# Altium project WS-LORA.PrjPcb
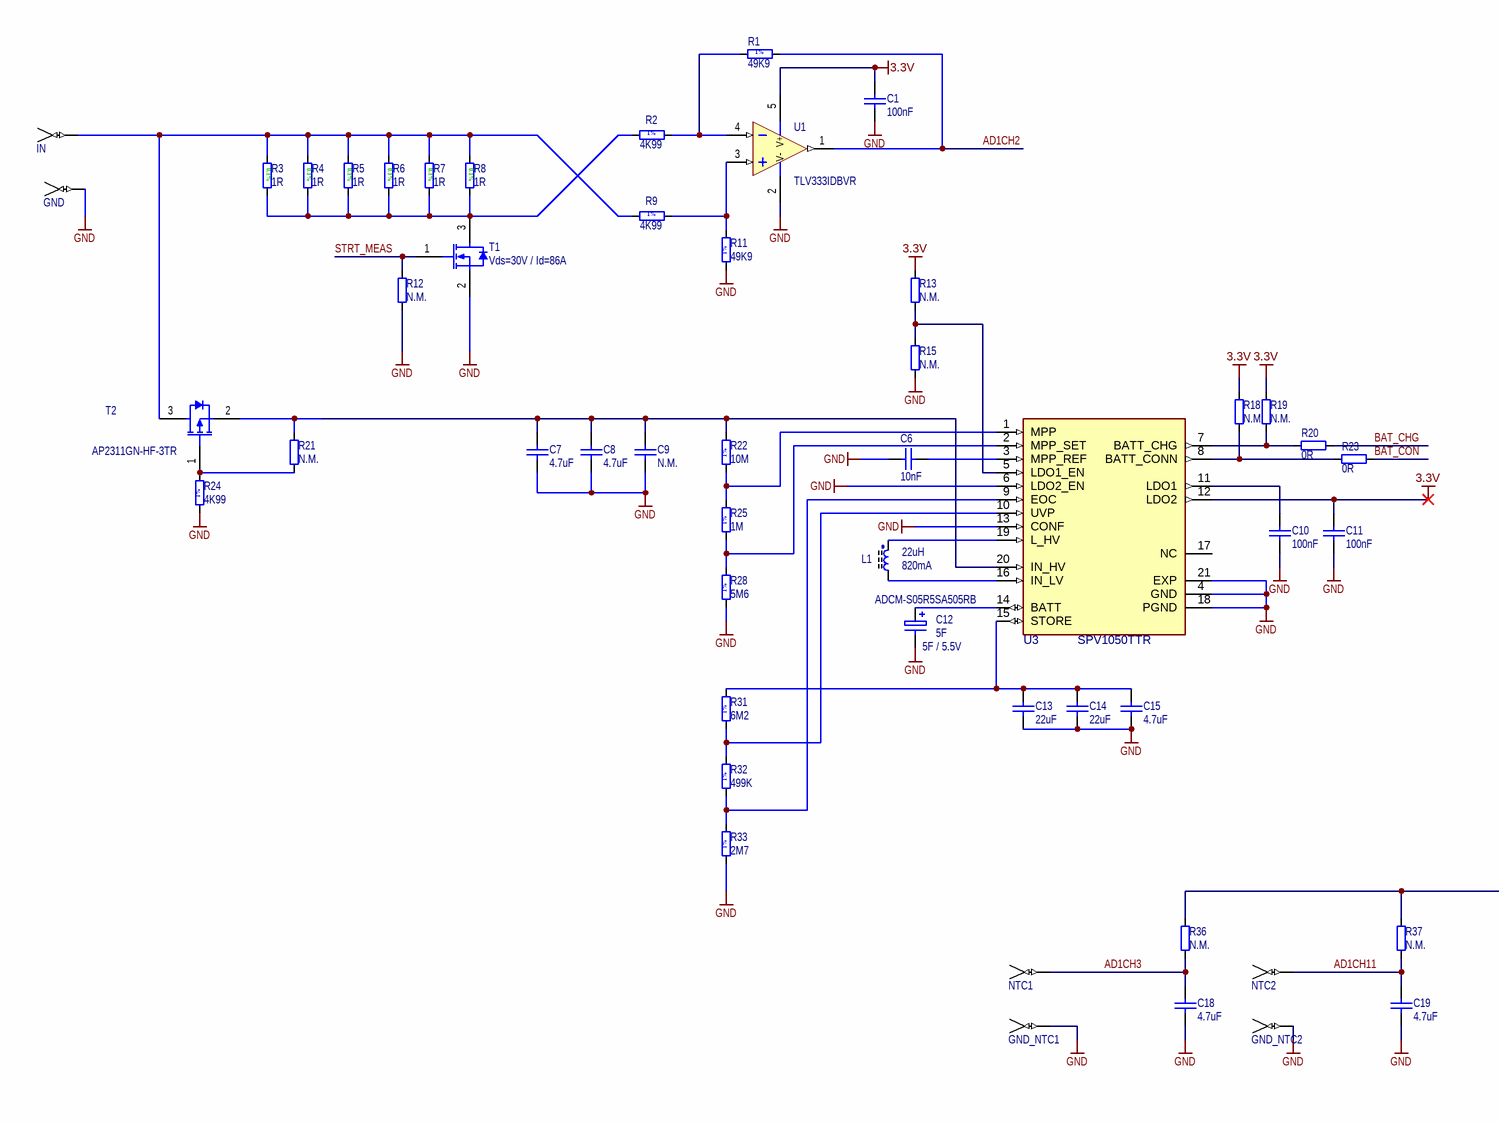
[diagram p0: LORATA.SchDoc, left]
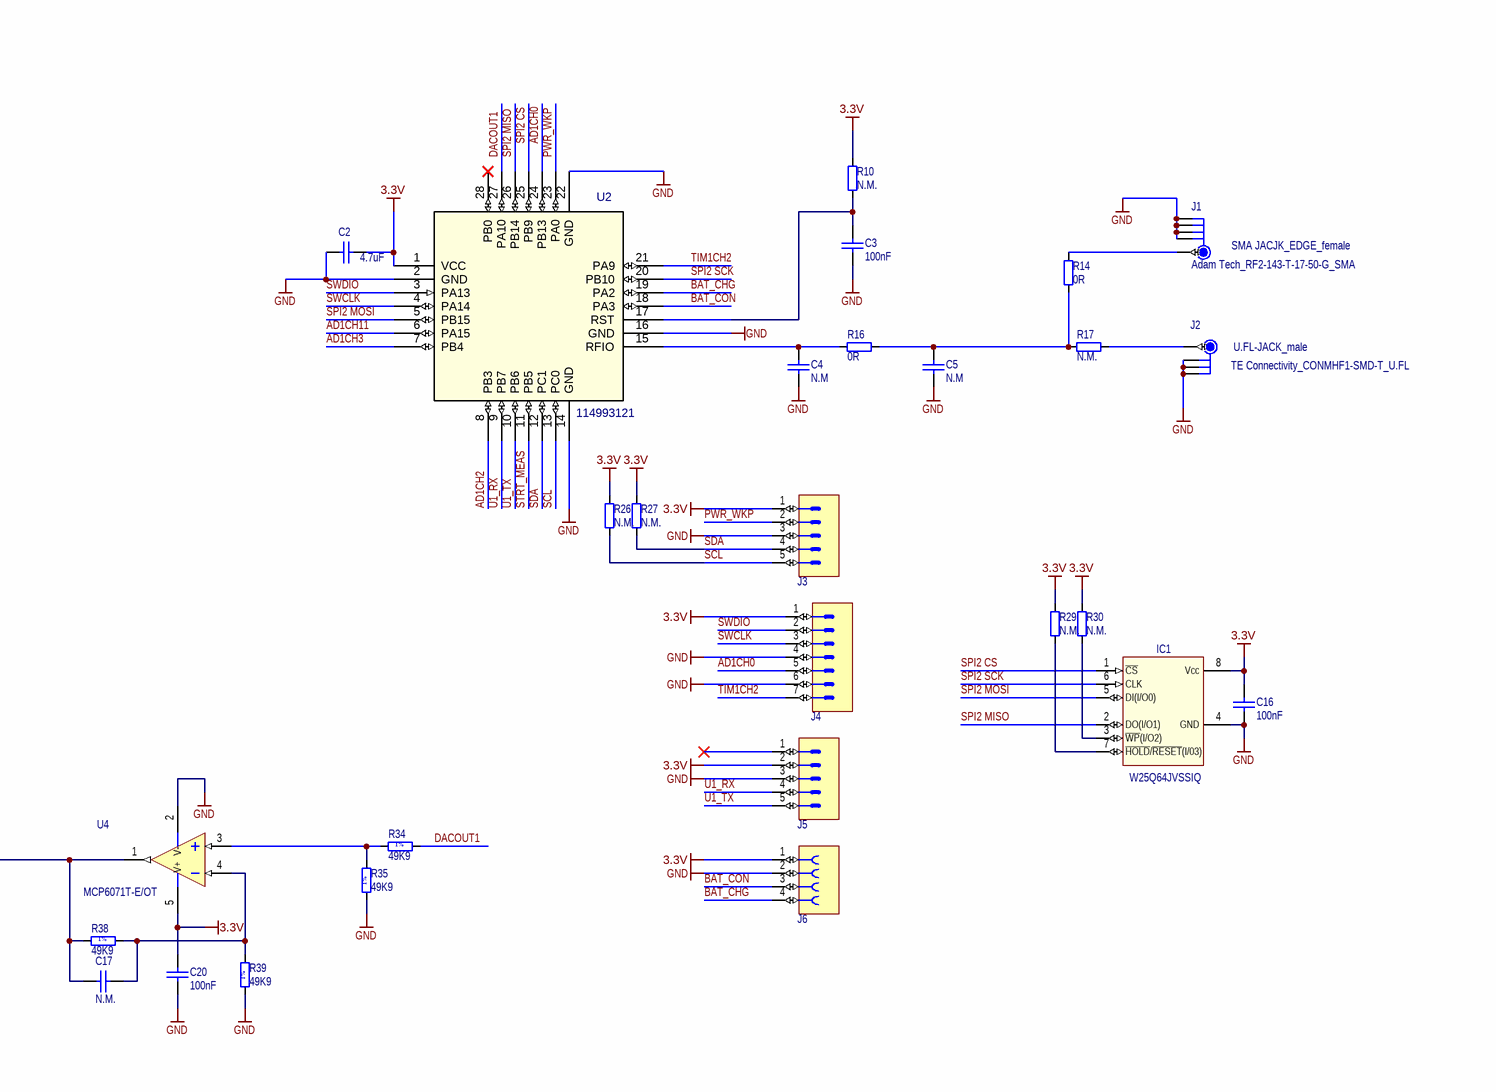
[diagram p1: LORATA.SchDoc, right]
1 sheet, 79 parts. Net scope: global (net labels, ports and power ports of the same name join across sheets).
Board file: WS_LORA.PcbDoc

## Sheet LORATA.SchDoc
size A2; DocumentNumber: 2; SheetNumber: 2; SheetTotal: 4

### Parts
C1  100nF  [CAPC1608N]
C2  4.7uF  [CAPC3216N]
C3  100nF  [CAPC1608N]
C4  N.M  [CAPC1608N]
C5  N.M  [CAPC1608N]
C6  10nF  [CAPC1608N]
C7  4.7uF  [CAPC3216N]
C8  4.7uF  [CAPC3216N]
C9  N.M.  [CAPC2012N]
C10  100nF  [CAPC1608N]
C11  100nF  [CAPC1608N]
C12  5F  Comment_Ratings: 5F / 5.5V  Manufacturer Part Number: ADCM-S05R5SA505RB  [CAPR1530x1050X2050X2800]
C13  22uF  [CAPC3225N]
C14  22uF  [CAPC3225N]
C15  4.7uF  [CAPC3216N]
C16  100nF  [CAPC1608N]
C17  N.M.  [CAPC2012N]
C18  4.7uF  [CAPC3216N]
C19  4.7uF  [CAPC3216N]
C20  100nF  [CAPC1608N]
GND  (no value)  [PIN_1.5MM_HOLE]  (no BOM)
GND_NTC1  (no value)  [PIN_1.5MM_HOLE]  (no BOM)
GND_NTC2  (no value)  [PIN_1.5MM_HOLE]  (no BOM)
IC1  W25Q64JVSSIQ  [SOIC127P600-8N]
IN  (no value)  [PIN_1.5MM_HOLE]  (no BOM)
J1  SMA JACJK_EDGE_female  Part Number: Adam Tech_RF2-143-T-17-50-G_SMA  [Adam Tech_RF2-143-T-17-50-G]
J2  U.FL-JACK_male  Part Number: TE Connectivity_CONMHF1-SMD-T_U.FL  [LINX_CONMHF1-SMD-T]
J3  HEADER 1X5  [HDR1X5]  (value not drawn)
J4  HEADER 1X7  [HDR1X7]  (value not drawn)
J5  HEADER 1X5  [HDR1X5]  (value not drawn)
J6  Header Female  [HARWIN_M20-7820442]  (value not drawn)
L1  22uH  Power: 820mA  [IND_Taiyo_NRS5024]
NTC1  (no value)  [PIN_1.5MM_HOLE]  (no BOM)
NTC2  (no value)  [PIN_1.5MM_HOLE]  (no BOM)
R1  49K9  [RESC1608N(0603)]
R2  4K99  [RESC2012N(0805)]
R3  1R  [RESC3216N(1206)]
R4  1R  [RESC3216N(1206)]
R5  1R  [RESC3216N(1206)]
R6  1R  [RESC3216N(1206)]
R7  1R  [RESC3216N(1206)]
R8  1R  [RESC3216N(1206)]
R9  4K99  [RESC2012N(0805)]
R10  N.M.  [RESC1608N(0603)]
R11  49K9  [RESC1608N(0603)]
R12  N.M.  [RESC1608N(0603)]
R13  N.M.  [RESC1608N(0603)]
R14  0R  [RESC1608N(0603)]
R15  N.M.  [RESC1608N(0603)]
R16  0R  [RESC1608N(0603)]
R17  N.M.  [RESC1608N(0603)]
R18  N.M.  [RESC1608N(0603)]
R19  N.M.  [RESC1608N(0603)]
R20  0R  [RESC1608N(0603)]
R21  N.M.  [RESC1608N(0603)]
R22  10M  [RESC2012N(0805)]
R23  0R  [RESC1608N(0603)]
R24  4K99  [RESC2012N(0805)]
R25  1M  [RESC2012N(0805)]
R26  N.M.  [RESC1608N(0603)]
R27  N.M.  [RESC1608N(0603)]
R28  5M6  [RESC2012N(0805)]
R29  N.M.  [RESC1608N(0603)]
R30  N.M.  [RESC1608N(0603)]
R31  6M2  [RESC2012N(0805)]
R32  499K  [RESC2012N(0805)]
R33  2M7  [RESC2012N(0805)]
R34  49K9  [RESC1608N(0603)]
R35  49K9  [RESC1608N(0603)]
R36  N.M.  [RESC1608N(0603)]
R37  N.M.  [RESC1608N(0603)]
R38  49K9  [RESC1608N(0603)]
R39  49K9  [RESC1608N(0603)]
T1  Comment_Ratings: Vds=30V / Id=86A  [TO228P991X239-3N-R546X521]  (hidden comment: IRLR8726PBF)
T2  AP2311GN-HF-3TR  [SOT95P240X130-3N]
U1  TLV333IDBVR  [SOT95P280X145-5N]
U2  114993121  [QFN_90687_SEE-L]
U3  SPV1050TTR  [QFN40P300X300X100-21N]
U4  MCP6071T-E/OT  [SOT95P280X145-5N]

### Nets
3.3V: C1.2 C2.2 C11.2 C16.2 C20.2 IC1.8(Vcc) J3.1 J4.1 J5.2 J6.1 R10.2 R13.2 R18.2 R19.2 R26.2 R27.2 R29.2 R30.2 U1.5(V+) U2.1(VCC) U3.12(LDO2) U4.5(V+)
GND: C1.1 C2.1 C3.1 C4.1 C5.1 C6.2 C7.1 C8.1 C9.1 C10.1 C11.1 C12.2 C13.1 C14.1 C15.1 C16.1 C18.1 C19.1 C20.1 GND.1 GND_NTC1.1 GND_NTC2.1 IC1.4(GND) J1.2 J1.3 J1.4 J1.5 J2.2 J2.3 J2.4 J3.3 J4.4 J4.6 J5.3 J6.2 R11.1 R12.1 R15.1 R24.1 R28.1 R33.1 R35.1 R39.1 T1.2(S) U1.2(V-) U2.2(GND) U2.14(GND) U2.16(GND) U2.22(GND) U3.4(GND) U3.6(LDO2_EN) U3.13(CONF) U3.18(PGND) U3.21(EXP) U4.2(V-)
AD1CH0: J4.5 U2.24(PB13)
AD1CH2: R1.2 U1.1(OUT) U2.8(PB3)
AD1CH3: C18.2 NTC1.1 R36.1 U2.7(PB4)
AD1CH11: C19.2 NTC2.1 R37.1 U2.6(PA15)
BAT_CHG: J6.4 R20.2 U2.19(PA2)
BAT_CON: J6.3 R23.2 U2.18(PA3)
DACOUT1: R34.2 U2.27(PA10)
PWR_WKP: J3.2 U2.23(PA0)
SCL: J3.5 R26.1 U2.13(PC0)
SDA: J3.4 R27.1 U2.12(PC1)
SPI2 CS: IC1.1(~{CS}) U2.25(PB9)
SPI2 MISO: IC1.2(DO(I/O1)) U2.26(PB14)
SPI2 MOSI: IC1.5(DI(I/O0)) U2.5(PB15)
SPI2 SCK: IC1.6(CLK) U2.20(PB10)
STRT_MEAS: R12.2 T1.1(G) U2.11(PB5)
SWCLK: J4.3 U2.4(PA14)
SWDIO: J4.2 U2.3(PA13)
TIM1CH2: J4.7 U2.21(PA9)
U1_RX: J5.4 U2.9(PB7)
U1_TX: J5.5 U2.10(PB6)
NetC3_2: C3.2 R10.1 U2.17(RST)
NetC4_2: C4.2 R16.1 U2.15(RFIO)
NetC5_2: C5.2 R14.1 R16.2 R17.1
NetC6_1: C6.1 U3.3(MPP_REF)
NetC7_2: C7.2 C8.2 C9.2 R21.2 R22.2 T2.2(S) U3.20(IN_HV)
NetC10_2: C10.2 U3.11(LDO1)
NetC12_1: C12.1 U3.14(BATT)
NetC13_2: C13.2 C14.2 C15.2 R31.2 U3.15(STORE)
NetC17_1: C17.1 R38.1 R39.2 U4.4(-IN)
NetC17_2: C17.2 R36.2 R37.2 R38.2 U4.1(OUT)
NetIC1_3: IC1.3(~{WP}(I/O2)) R30.1
NetIC1_7: IC1.7(~{HOLD}/~{RESET}(I/03)) R29.1
NetIN_1: IN.1 R3.1 R4.1 R5.1 R6.1 R7.1 R8.1 R9.1 T2.3(D)
NetJ1_1: J1.1 R14.2
NetJ2_1: J2.1 R17.2
NetL1_1: L1.1 U3.19(L_HV)
NetL1_2: L1.2 U3.16(IN_LV)
NetR1_1: R1.1 R2.2 U1.4(-IN)
NetR2_1: R2.1 R3.2 R4.2 R5.2 R6.2 R7.2 R8.2 T1.3(D)
NetR9_2: R9.2 R11.2 U1.3(+IN)
NetR13_1: R13.1 R15.2 U3.5(LDO1_EN)
NetR18_1: R18.1 R23.1 U3.8(BATT_CONN)
NetR19_1: R19.1 R20.1 U3.7(BATT_CHG)
NetR21_1: R21.1 R24.2 T2.1(G)
NetR22_1: R22.1 R25.2 U3.1(MPP)
NetR25_1: R25.1 R28.2 U3.2(MPP_SET)
NetR31_1: R31.1 R32.2 U3.10(UVP)
NetR32_1: R32.1 R33.2 U3.9(EOC)
NetR34_1: R34.1 R35.2 U4.3(+IN)

Not connected (* = marked no-connect by the designer): J5 1*; U2 28(PB0)*; U3 17(NC)

### Notes on the sheet
- Indrivetec AG  confidential
- Indrivetec AG
- Hagenholzstrasse 71, CH-8050 Zürich
- www.indrivetec.ch <http://www.indrivetec.ch>
- This document contains intellectual property belonging to Indrivetec AG.
  Any reproduction, distribution or exhibition is not allowed without the written consent of Indrivetec AG. Unauthorized use, disclosure, dissemination or duplication of any of the information contained herein may result in liability under applicable laws.
- CONFIDENTIAL
- Drawn by:
- Checked:
- Approved:
- Modified:
- Printed:
- Created:
- A3
- Sheet:
- of
- (in symbol R0603_49K9_1%_0.1W_100PPM) 1%
- (in symbol R0805_1M_1%_0.125W_100PPM) 1%
- (in symbol R0805_2M7_1%_0.125W_100PPM) 1%
- (in symbol R0805_4K99_1%_0.125W_100PPM) 1%
- (in symbol R0805_5M6_1%_0.125W_100PPM) 1%
- (in symbol R0805_6M2_1%_0.125W_100PPM) 1%
- (in symbol R0805_10M_1%_0.125W_100PPM) 1%
- (in symbol R0805_499K_1%_0.125W_100PPM) 1%
- (in symbol R1206_1R_0.5%_0.52W_25PPM) 0.1%

### Library data of the parts
C1 C3 C10 C11 C16 C20 = CC0603_100NF_50V_10%_X7R: Non-polarised capacitor; Part Description: SMD Multilayer Chip Ceramic Capacitor; Manufacturer: GENERIC; Manufacturer1 Part Number: C1608X7R1H104K080AA; Comment_Ratings: 100nF / 50V; Voltage: 50V; TC: X7R; Tolerance: ±10%; Table: Capacitors SMD; Elinvent_Num: 33-1002-02; Part Number: CC0603_100NF_50V_10%_X7R; Component Kind: Standard; Component Type: Standard; Pin Count: 2; Value: 100nF; Status: Preferred; Manufacturer Part Number: CC0603_100NF_50V_10%_X7R; Case: 0603; Mounted: Yes; Socket: No; SMD: Yes; Manufacturer1 Example: TDK; Manufacturer1 ComponentHeight: 0.87mm; HelpURL: \\IDT-SRV102\Bulgaria\Bulgaria\Altium\Datasheets\mlcc_commercial_general_en.pdf; Author: V.Shishkov; CreateDate: 13/07/2015; LatestRevisionDate: 13/07/2015
C2 C7 C8 C15 C18 C19 = CC1206_4.7UF_50V_10%_X7R: Non-polarised capacitor; Part Description: SMD Multilayer Chip Ceramic Capacitor; Manufacturer: GENERIC; Manufacturer1 Part Number: C3216X7R1H475K160AC; Voltage: 50V; TC: X7R; Tolerance: ±10%; Table: Capacitors SMD; Elinvent_Num: 33-1058-04; Comment_Ratings: 4.7uF / 50V; Part Number: CC1206_4.7UF_50V_10%_X7R; Component Kind: Standard; Component Type: Standard; Pin Count: 2; Value: 4.7uF; Status: Preferred; Manufacturer Part Number: CC1206_4.7UF_50V_10%_X7R; Case: 1206; Mounted: Yes; Socket: No; SMD: Yes; Manufacturer1 Example: TDK; Manufacturer1 ComponentHeight: 1.60mm; HelpURL: \\IDT-SRV102\Bulgaria\Altium\Datasheets\mlcc_commercial_general_en.pdf; Author: V.Shishkov; CreateDate: 13/07/2015; LatestRevisionDate: 13/07/2015
C4 C5 = CC0603_NO-VALUE: Non-polarised capacitor; Part Description: SMD Multilayer Chip Ceramic Capacitor; Manufacturer: GENERIC; Table: Capacitors SMD; Part Number: CC0603_NO-VALUE; Component Kind: Standard; Component Type: Standard; Pin Count: 2; Comment_Ratings: N.M; Value: N.M; Status: Preferred; Manufacturer Part Number: CC0603_NO-VALUE; Case: 0603; Mounted: Yes; Socket: No; SMD: Yes; Manufacturer1 ComponentHeight: 0.87mm; HelpURL: Undefined; Author: L.K; CreateDate: 15/03/2016; LatestRevisionDate: 15/03/2016
C6 = CC0603_10NF_50V_10%_X7R: Non-polarised capacitor; Part Description: SMD Multilayer Chip Ceramic Capacitor; Manufacturer: GENERIC; Manufacturer1 Part Number: C1608X7R1H103K080AA; Comment_Ratings: 10nF / 50V; Voltage: 50V; TC: X7R; Tolerance: ±10%; Table: Capacitors SMD; Elinvent_Num: 33-1004-02; Part Number: CC0603_10NF_50V_10%_X7R; Component Kind: Standard; Component Type: Standard; Pin Count: 2; Value: 10nF; Status: Preferred; Manufacturer Part Number: CC0603_10NF_50V_10%_X7R; Case: 0603; Mounted: Yes; Socket: No; SMD: Yes; Manufacturer1 Example: TDK; Manufacturer1 ComponentHeight: 0.87mm; HelpURL: \\IDT-SRV102\Bulgaria\Altium\Datasheets\mlcc_commercial_general_en.pdf; Author: V.Shishkov; CreateDate: 13/07/2015; LatestRevisionDate: 13/07/2015
C9 C17 = CC0805_NO-VALUE: Non-polarised capacitor; Part Description: Reserved Footprint For 0805(2012) Chip Ceramic Capacitor; Manufacturer: Undefined; Mounted: No; Table: Capacitors SMD; Part Number: CC0805_NO-VALUE; Component Kind: Standard; Component Type: Standard (No BOM); Pin Count: 2; Comment_Ratings: N.M.; Value: N.M.; Status: None; Manufacturer Part Number: CC0805_NO-VALUE; Case: 0805; Socket: No; SMD: Yes; Manufacturer1 ComponentHeight: 1.35mm; HelpURL: Undefined; Author: V.Shishkov; CreateDate: 13/07/2015; LatestRevisionDate: 13/07/2015
C12 = CAER_5F_5.5V_0%+30%: Polarised capacitor; Part Description: 5 F (EDLC) Supercapacitor 5.5 V Radial 160mOhm @ 1kHz; Manufacturer: Abracon LLC; Voltage: 5.5V; Tolerance: 0%+30%; Table: Capacitors THD; Part Number: CAER_5F_5.5V_0%+30%; Component Kind: Standard; Component Type: Standard; Pin Count: 2; Value: 5F; Status: None; Case: LS15.3 D20.5 x T10.5 x H28; Mounted: Yes; Socket: No; SMD: No; ComponentHeight: 28mm; HelpURL: \\IDT-SRV102\Bulgaria\Altium\Datasheets\ADCM-S05R5S.pdf; Author: L.Karamfilov; CreateDate: 16/01/2025; LatestRevisionDate: 07/03/2012
C13 C14 = CC1210_22UF_16V_10%_X7R: Non-polarised capacitor; Part Description: SMD Multilayer Chip Ceramic Capacitor; Manufacturer: GENERIC; Manufacturer Part Number: CC1210_22UF_10V_10%_X7R; Manufacturer1 Part Number: C3225X7R1C226K250AC; Comment_Ratings: 22uF / 16V; Voltage: 16V; TC: X7R; Tolerance: ±10%; Table: Capacitors SMD; Elinvent_Num: 33-1005-05; Part Number: CC1210_22UF_16V_10%_X7R; Component Kind: Standard; Component Type: Standard; Pin Count: 2; Value: 22uF; Status: Preferred; Case: 1210; Mounted: Yes; Socket: No; SMD: Yes; Manufacturer1 Example: TDK; Manufacturer1 ComponentHeight: 2.50mm; HelpURL: \\IDT-SRV102\Bulgaria\Altium\Datasheets\mlcc_commercial_general_en.pdf; Author: V.Shishkov; CreateDate: 13/07/2015; LatestRevisionDate: 13/07/2015
GND GND_NTC1 GND_NTC2 IN NTC1 NTC2 = PAD_1.5mm_HOLE: Through Hole Pad; Part Description: Place for CABLE SOLDER; Mounted: No; Part Number: PAD_1.5mm_HOLE; Component Type: Standard(No BOM); Pin Count: 1; PackageDescription: PAD-1.5MM HOLE_ 2.3 MM  RING; Socket: No; SMD: No; Status: None; ComponentHeight: 0mm; Author: L.K; CreateDate: 05/12/2017; LatestRevisionDate: 05/12/2017
IC1 = W25Q64JVSSIQ: FLASH - NOR Memory IC 64Mbit SPI - Quad I/O 133 MHz 8-SOIC; Manufacturer: Winbond Electronics; Table: Logic; Part Number: W25Q64JVSSIQ; Component Kind: Standard; Component Type: Standard; Device: W25Q64JVSSIQ; Footprint: SOIC127P600X175-8N; PackageDescription: SOIC 8, Pitch 1.27mm - Body 4x5mm, IPC Medium Density; Part Description: FLASH - NOR Memory IC 64Mbit SPI - Quad I/O 133 MHz 8-SOIC; Manufacturer Part Number: W25Q64JVSSIQ; Pin Count: 8; Case: SOIC8; Mounted: Yes; Socket: No; SMD: Yes; ComponentHeight: 1.75mm; HelpURL: \\IDT-SRV102\Bulgaria\Altium\Datasheets\w25q64jv revj 03272018 plus.pdf; Author: L.Karamfilov; CreateDate: 16/01/2025; LatestRevisionDate: 30/11/2015
J1 = Adam Tech_RF2-143-T-17-50-G_SMA: Part Description: SMA Connector Jack, Female Socket 50 Ohms Board Edge, End Launch Solder; Table: Miscellaneous; Component Kind: Standard; Component Type: Standard; Device: SMA JACJK_EDGE_female; Pin Count: 5; Family: RF; Mounted: Yes; Socket: No; SMD: Yes; Status: None; Manufacturer: Adam Tech; Manufacturer Part Number: RF2-143-T-17-50-G; ComponentHeight: 3.54mm; HelpURL: \\IDT-SRV102\Bulgaria\Altium\Datasheets\rf2-143-t-17-50-g-data-sheet.pdf; Author: L.KARAMFILOV; CreateDate: 28/02/2025; LatestRevisionDate: 22/07/2015
J2 = TE Connectivity_CONMHF1-SMD-T_U.FL: Part Description: U.FL (UMCC) Connector Jack, Male Pin 50 Ohms Surface Mount Solder; Manufacturer: TE Connectivity Linx; Table: Miscellaneous; Component Kind: Standard; Component Type: Standard; Device: U.FL-JACK_male; Pin Count: 4; Family: U.FL-Type; Mounted: Yes; Socket: No; SMD: Yes; Status: None; Manufacturer Part Number: CONMHF1-SMD-T; ComponentHeight: 1.25mm; HelpURL: \\IDT-SRV102\Bulgaria\Altium\Datasheets\ENG_DS_conmhf1-smd-g-t-ds_A1.pdf; Author: L.KARAMFILOV; CreateDate: 28/02/2025; LatestRevisionDate: 22/07/2015
J3 J5 = HEADER 1 X 5_2.54MM: Connector 5 Male; Part Description: 5 Contacts - Pitch 2.54mm; Manufacturer Part Number: DO NOT MOUNT; Mounted: No; Table: Miscellaneous; Part Number: HEADER 1 X 5_2.54MM; Component Kind: Standard; Component Type: Standard; Device: HEADER 1X5; Pin Count: 5; Socket: No; SMD: No; Status: None; Author: L.K; CreateDate: 05/04/2016; LatestRevisionDate: 05/04/2016
J4 = HEADER 1 X 7_2.54MM: Connector 7 Male; Part Description: 7 Contacts - Pitch 2.54mm; Manufacturer Part Number: DO NOT MOUNT; Mounted: No; Table: Miscellaneous; Part Number: HEADER 1 X 7_2.54MM; Component Kind: Standard; Component Type: Standard; Device: HEADER 1X7; Pin Count: 7; Socket: No; SMD: No; Status: None; Author: L.K; CreateDate: 16/06/2022; LatestRevisionDate: 05/04/2016
J6 = M20-7820442: Connector 4 Female; Part Description: 4 Contacts - 	Connector  Receptacle 4 Position 0.100" (2.54mm) Gold Through ole single row; Manufacturer: HARWIN; Elinvent_Num: 38-2064-01; Table: Miscellaneous; Part Number: M20-7820442; Component Kind: Standard; Component Type: Standard; Device: Header Female; Pin Count: 4; Family: M20-782; Mounted: Yes; Socket: No; SMD: No; Status: None; Manufacturer Part Number: M20-7820442; ComponentHeight: 8.64mm; HelpURL: \\IDT-SRV102\Bulgaria\Altium\Datasheets\M20-782.pdf; Author: L.KARAMFILOV; CreateDate: 20/10/2015; LatestRevisionDate: 20/10/2015
L1 = IND_22UH_20%_Taiyo-Yuden_NRS5024T220MMGJV: Inductor; Part Description: 22 µH Shielded Drum Core, Wirewound Inductor 820 mA 276mOhm Max Nonstandard; Manufacturer: Taiyo Yuden; Comment_Ratings: 22uH / 0.82A; Resistance: 0.276R; Tolerance: ±20%; Table: Inductors SMD; Author: L.KARAMFILOV; Part Number: IND_22UH_20%_Taiyo-Yuden_NRS5024T220MMGJV; Component Kind: Standard; Component Type: Standard; Pin Count: 2; Value: 22uH; Manufacturer Part Number: NRS5024T220MMGJV; Case: NRS5024; Mounted: Yes; Socket: No; SMD: Yes; ComponentHeight: 3.2mm; HelpURL: \\IDT-SRV102\Bulgaria\Altium\Datasheets\NRS5024T220MMGJV_SS.pdf; CreateDate: 07/03/2025; LatestRevisionDate: 05/12/2017
R1 R11 R34 R35 R38 R39 = R0603_49K9_1%_0.1W_100PPM: Resistor-1%; Part Description: General Purpose Thick Film Chip Resistor; Manufacturer: GENERIC; Manufacturer1 Part Number: RC0603FR-0749K9L; Comment_Ratings: 49K9 / 0.1W; Power: 0.1W; TC: ±100ppm/°C; Tolerance: ±1%; Table: Resistors SMD; Part Number: R0603_49K9_1%_0.1W_100PPM; Component Kind: Standard; Component Type: Standard; Pin Count: 2; Value: 49K9; Status: Preferred; Manufacturer Part Number: R0603_49K9_1%_0.1W_100PPM; Case: 0603; Mounted: Yes; Socket: No; SMD: Yes; ComponentHeight: 0.45±0.10mm; Manufacturer1 Example: YAGEO PHYCOMP; Manufacturer1 ComponentHeight: 0.55mm; HelpURL: \\IDT-SRV102\Bulgaria\Altium\Datasheets\PYu-RC_Group_51_RoHS_L_2.pdf; Author: L.KARAMFILOV; CreateDate: 01/09/2016; LatestRevisionDate: 01/09/2016
R2 R9 R24 = R0805_4K99_1%_0.125W_100PPM: Resistor-1%; Part Description: General Purpose Thick Film Chip Resistor; Manufacturer: Vishay Dale; Manufacturer1 Part Number: CRCW08054K99FKEA; Comment_Ratings: 4K99 / 0.125W; Power: 0.125W; TC: ±100ppm/°C; Tolerance: ±1%; Table: Resistors SMD; Part Number: R0805_4K99_1%_0.125W_100PPM; Component Kind: Standard; Component Type: Standard; Pin Count: 2; Value: 4K99; Status: Preferred; Manufacturer Part Number: R0805_4K99_1%_0.125W_100PPM; Case: 0805; Mounted: Yes; Socket: No; SMD: Yes; ComponentHeight: 0.50±0.10mm; Manufacturer1 Example: VISHAY; Manufacturer1 ComponentHeight: 0.5mm; HelpURL: \\IDT-SRV102\Bulgaria\Altium\Datasheets\dcrcwe3 (1).pdf; Author: L.KARAMFILOV; CreateDate: 07/03/2025; LatestRevisionDate: 19/12/2016
R3-R8 = R1206_1R_0.5%_0.52W_25PPM: Resistor-0.1%; Part Description: 1 Ohms ±0.5% 0.52W Chip Resistor 1206 (3216 Metric) Anti-Sulfur, Automotive AEC-Q200, Moisture Resistant Thin Film; Manufacturer: YAGEO; Manufacturer Part Number: TNPW12061R00DEEA; Manufacturer1 Part Number: RES 1 OHM 0.5% 0.52W 1206; Comment_Ratings: 1R / 0.52W / 25PPM; Power: 0.25W; TC: ±25ppm/°C; Tolerance: ±0.5%; Table: Resistors SMD; Value: 1R; Part Number: R1206_1R_0.5%_0.52W_25PPM; Component Kind: Standard; Component Type: Standard; Pin Count: 2; Status: Preferred; Case: 1206; Mounted: Yes; Socket: No; SMD: Yes; ComponentHeight: 0.55±0.10mm; Manufacturer1 Example: VISHAY; Manufacturer1 ComponentHeight: TNPW12061R00DEEA; HelpURL: \\IDT-SRV102\Bulgaria\Altium\Datasheets\recsoldpaddims-drabeyresfus.pdf; Author: L.KARAMFILOV; CreateDate: 29/07/2015; LatestRevisionDate: 29/07/2015
R10 R12 R13 R15 R17-R19 R21 R26 R27 R29 R30 R36 R37 = R0603_NO-VALUE: Resistor; Part Description: Reserved Footprint For a 0603 (1608) Chip Resistor; Manufacturer: Undefined; Mounted: No; Table: Resistors SMD; Value: N.M.; Part Number: R0603_NO-VALUE; Comment_Ratings: N.M.; Component Kind: Standard; Component Type: Standard (No BOM); Pin Count: 2; Status: None; Manufacturer Part Number: R0603_NO-VALUE; Case: 0603; Socket: No; SMD: Yes; ComponentHeight: 0.45±0.10mm; Manufacturer1 Example: Undefined; Manufacturer1 Part Number: Undefined; Manufacturer1 ComponentHeight: Undefined; HelpURL: \\IDT-SRV102\Bulgaria\Altium\Datasheets\.pdf; Author: L.KARAMFILOV; CreateDate: 10/07/2015; LatestRevisionDate: 10/07/2015
R14 R16 R20 R23 = R0603_0R_JUMPER: Resistor; Part Description: 1A (0.05R Max DC Resistance) Zero Ohm Jumper; Manufacturer: GENERIC; Manufacturer1 Part Number: RC0603JR-070RL; Elinvent_Num: 36-1001-03; Comment_Ratings: 0R / 1A Max; Table: Resistors SMD; Value: 0R; Part Number: R0603_0R_JUMPER; Component Kind: Standard; Component Type: Standard; Pin Count: 2; Status: Preferred; Manufacturer Part Number: R0603_0R_JUMPER; Case: 0603; Mounted: Yes; Socket: No; SMD: Yes; ComponentHeight: 0.45±0.10mm; Manufacturer1 Example: YAGEO PHYCOMP; Manufacturer1 ComponentHeight: 0.55mm; HelpURL: \\IDT-SRV102\Bulgaria\Altium\Datasheets\RC0603_V5.pdf; Author: L.KARAMFILOV; CreateDate: 10/07/2015; LatestRevisionDate: 10/07/2015
R22 = R0805_10M_1%_0.125W_100PPM: Resistor-1%; Part Description: General Purpose Thick Film Chip Resistor; Manufacturer: Vishay Dale; Manufacturer1 Part Number: CRCW080510M00FKEA; Comment_Ratings: 10M / 0.125W; Power: 0.125W; TC: ±100ppm/°C; Tolerance: ±1%; Table: Resistors SMD; Part Number: R0805_10M_1%_0.125W_100PPM; Component Kind: Standard; Component Type: Standard; Pin Count: 2; Value: 10M; Status: Preferred; Manufacturer Part Number: R0805_10M_1%_0.125W_100PPM; Case: 0805; Mounted: Yes; Socket: No; SMD: Yes; ComponentHeight: 0.50±0.10mm; Manufacturer1 Example: VISHAY; Manufacturer1 ComponentHeight: 0.5mm; HelpURL: \\IDT-SRV102\Bulgaria\Altium\Datasheets\dcrcwe3 (1).pdf; Author: L.KARAMFILOV; CreateDate: 07/03/2025; LatestRevisionDate: 19/12/2016
R25 = R0805_1M_1%_0.125W_100PPM: Resistor-1%; Part Description: General Purpose Thick Film Chip Resistor; Manufacturer: Vishay Dale; Manufacturer1 Part Number: CRCW08051M00FKEA; Comment_Ratings: 1M / 0.125W; Power: 0.125W; TC: ±100ppm/°C; Tolerance: ±1%; Table: Resistors SMD; Part Number: R0805_1M_1%_0.125W_100PPM; Component Kind: Standard; Component Type: Standard; Pin Count: 2; Value: 1M; Status: Preferred; Manufacturer Part Number: R0805_1M_1%_0.125W_100PPM; Case: 0805; Mounted: Yes; Socket: No; SMD: Yes; ComponentHeight: 0.50±0.10mm; Manufacturer1 Example: VISHAY; Manufacturer1 ComponentHeight: 0.5mm; HelpURL: \\IDT-SRV102\Bulgaria\Altium\Datasheets\dcrcwe3 (1).pdf; Author: L.KARAMFILOV; CreateDate: 07/03/2025; LatestRevisionDate: 19/12/2016
R28 = R0805_5M6_1%_0.125W_100PPM: Resistor-1%; Part Description: General Purpose Thick Film Chip Resistor; Manufacturer: Vishay Dale; Manufacturer1 Part Number: CRCW08055M60FKEA; Comment_Ratings: 5M6 / 0.125W; Power: 0.125W; TC: ±100ppm/°C; Tolerance: ±1%; Table: Resistors SMD; Part Number: R0805_5M6_1%_0.125W_100PPM; Component Kind: Standard; Component Type: Standard; Pin Count: 2; Value: 5M6; Status: Preferred; Manufacturer Part Number: R0805_5M6_1%_0.125W_100PPM; Case: 0805; Mounted: Yes; Socket: No; SMD: Yes; ComponentHeight: 0.50±0.10mm; Manufacturer1 Example: VISHAY; Manufacturer1 ComponentHeight: 0.5mm; HelpURL: \\IDT-SRV102\Bulgaria\Altium\Datasheets\dcrcwe3 (1).pdf; Author: L.KARAMFILOV; CreateDate: 07/03/2025; LatestRevisionDate: 19/12/2016
R31 = R0805_6M2_1%_0.125W_100PPM: Resistor-1%; Part Description: General Purpose Thick Film Chip Resistor; Manufacturer: Vishay Dale; Manufacturer1 Part Number: CRCW08056M20FKEA; Comment_Ratings: 6M2 / 0.125W; Power: 0.125W; TC: ±100ppm/°C; Tolerance: ±1%; Table: Resistors SMD; Part Number: R0805_6M2_1%_0.125W_100PPM; Component Kind: Standard; Component Type: Standard; Pin Count: 2; Value: 6M2; Status: Preferred; Manufacturer Part Number: R0805_6M2_1%_0.125W_100PPM; Case: 0805; Mounted: Yes; Socket: No; SMD: Yes; ComponentHeight: 0.50±0.10mm; Manufacturer1 Example: VISHAY; Manufacturer1 ComponentHeight: 0.5mm; HelpURL: \\IDT-SRV102\Bulgaria\Altium\Datasheets\dcrcwe3 (1).pdf; Author: L.KARAMFILOV; CreateDate: 07/03/2025; LatestRevisionDate: 19/12/2016
R32 = R0805_499K_1%_0.125W_100PPM: Resistor-1%; Part Description: Commercial Thin Film Resistor, Surface Mount Chip; Manufacturer: GENERIC; Manufacturer1 Part Number: RC0805FR-07499KL; Elinvent_Num: 36-1101-05; Comment_Ratings: 499K / 0.125W; Power: 0.125W; TC: ±100ppm/°C; Tolerance: ±1%; Table: Resistors SMD; Part Number: R0805_499K_1%_0.125W_100PPM; Component Kind: Standard; Component Type: Standard; Pin Count: 2; Value: 499K; Status: Preferred; Manufacturer Part Number: R0805_499K_1%_0.125W_100PPM; Case: 0805; Mounted: Yes; Socket: No; SMD: Yes; ComponentHeight: 0.55±0.10mm; Manufacturer1 Example: YAGEO PHYCOMP; Manufacturer1 ComponentHeight: 0.65mm; HelpURL: \\IDT-SRV102\Bulgaria\Altium\Datasheets\PYu-R_INT-thick_7.pdf; Author: L.KARAMFILOV; CreateDate: 09/05/2017; LatestRevisionDate: 09/05/2017
R33 = R0805_2M7_1%_0.125W_100PPM: Resistor-1%; Part Description: General Purpose Thick Film Chip Resistor; Manufacturer: Vishay Dale; Manufacturer1 Part Number: CRCW08052M70FKEA; Comment_Ratings: 2M7 / 0.125W; Power: 0.125W; TC: ±100ppm/°C; Tolerance: ±1%; Table: Resistors SMD; Part Number: R0805_2M7_1%_0.125W_100PPM; Component Kind: Standard; Component Type: Standard; Pin Count: 2; Value: 2M7; Status: Preferred; Manufacturer Part Number: R0805_2M7_1%_0.125W_100PPM; Case: 0805; Mounted: Yes; Socket: No; SMD: Yes; ComponentHeight: 0.50±0.10mm; Manufacturer1 Example: VISHAY; Manufacturer1 ComponentHeight: 0.5mm; HelpURL: \\IDT-SRV102\Bulgaria\Altium\Datasheets\dcrcwe3 (1).pdf; Author: L.KARAMFILOV; CreateDate: 07/03/2025; LatestRevisionDate: 19/12/2016
T1 = IRLR8726PBF: N-channel FET transistor in SOT-23; Part Description: MOSFET N-CH 30V 86A DPAK; Manufacturer: INFINEON TECHNOLOGIES; Table: Transistors; Elinvent_Num: 40-1070-00; Part Number: IRLR8726PBF; Component Kind: Standard; Component Type: Standard; Device: IRLR8726PBF; PackageDescription: TO-252AA DPAK TO, 2.28mm pitch; 2 pin,9.905mm L X 6.095mm W X 2.39mm H body, IPC Medium Density; Manufacturer Part Number: IRLR8726PBF; Pin Count: 3; Case: TO252-AA; Mounted: Yes; Socket: No; SMD: Yes; ComponentHeight: 2.39mm; HelpURL: \\IDT-SRV102\Bulgaria\Altium\Datasheets\irlr8726pbf.pdf; Author: L.Karmafilov; CreateDate: 19/01/2017; LatestRevisionDate: 19/01/2017
T2 = AP2311GN-HF-3TR: P-channel FET transistor in SOT-23; Part Description: PMOS 60V 1.8A 1.38W 250mOhm/10V; 300mOhm/4.5V; Manufacturer: ADVANCED POWER ELECTR. CO; Comment_Ratings: Vds=60V / Id=1.8A; Table: Transistors; Part Number: AP2311GN-HF-3TR; Component Kind: Standard; Component Type: Standard; Device: AP2311GN-HF-3TR; PackageDescription: SOT23 3-Leads, Pitch 0.95mm - Body 1.3x2.9mm, IPC Medium Density; Manufacturer Part Number: AP2311GN-HF-3TR; Pin Count: 3; Case: SOT23-2; Mounted: Yes; Socket: No; SMD: Yes; ComponentHeight: 1.11mm; HelpURL: \\IDT-SRV102\Bulgaria\Altium\Datasheets\AP2311GN-3.pdf; Author: L.Karmafilov; CreateDate: 09/03/2025; LatestRevisionDate: 22/12/2015
U1 = TLV333IDBVR: Single Op Amp in SOT23/5; Part Description: Zero-Drift Amplifier 1 Circuit Rail-to-Rail SOT-23-5; Manufacturer: TEXAS INSTRUMENTS; Table: Operational Amplifiers; Part Number: TLV333IDBVR; Component Kind: Standard; Component Type: Standard; Device: TLV333IDBVR; PackageDescription: SOT23-5, 0.95mm pitch; 5 pin, 1.60mm W X 2.90mm L X 1.45mm H body, IPC Medium; Manufacturer Part Number: TLV333IDBVR; Pin Count: 5; Case: SOT23-5; Mounted: Yes; Socket: No; SMD: Yes; ComponentHeight: 1.75mm; Author: L.Karamfilov; HelpURL: \\IDT-SRV102\Bulgaria\Altium\Datasheets\tlv333.pdf; CreateDate: 04/03/2025; LatestRevisionDate: 19/05/2010
U2 = 114993121_RF_SEED: WIO-E5-LE WIRELESS MODULE (TAPE); Mfr_Name: BeagleBoard; Part Description: General ISM < 1GHz LoRaWAN Transceiver Module 868MHz, 915MHz Antenna Not Included Surface Mount; Manufacturer: Seeed Technology Co., Ltd; Table: PCB Modules; RefDes: RefDes; Type: Type; Part Number: 114993121_RF_SEED; Component Kind: Standard; Component Type: Standard; Device: 114993121; PackageDescription: 28-SMD Module; Manufacturer Part Number: 114993121; Pin Count: 28; Mounted: Yes; Socket: No; SMD: Yes; ComponentHeight: 2.5mm; Author: L.Karamfilov; HelpURL: \\IDT-SRV102\Bulgaria\Altium\Datasheets\Wio-E5-LE module datasheet_v1.0.pdf; CreateDate: 16/01/2025; LatestRevisionDate: 07/11/2017
U3 = SPV1050TTR: Charger IC Multi-Chemistry 20-VFQFPN (3x3); Part Description: IC BATT CHG MULTI-CHEM 20VFQFPN; MF: STMicroelectronics; Table: Analog & Interface; SnapEDA_Link: https://www.snapeda.com/parts/SPV1050TTR/STMicroelectronics/view-part/?ref=snap; Package: VFQFN-20 STMicroelectronics; Value: *; MP: SPV1050TTR; Check_prices: https://www.snapeda.com/parts/SPV1050TTR/STMicroelectronics/view-part/?ref=eda; Part Number: SPV1050TTR; Component Kind: Standard; Component Type: Standard; Device: SPV1050TTR; PackageDescription: 20-VFQFN Exposed Pad(3mm × 3mm); Manufacturer: STMicroelectronics; Manufacturer Part Number: SPV1050TTR; Pin Count: 21; Case: 20-VFQFN; Mounted: Yes; Socket: No; SMD: Yes; ComponentHeight: 0.75mm; Author: L.Karamfilov; HelpURL: \\IDT-SRV102\Bulgaria\Altium\Datasheets\en.DM00100984.pdf; CreateDate: 16/01/2025; LatestRevisionDate: 01/06/2018
U4 = MCP6071T-E/OT: Single Op Amp in SOT23/5; Part Description: OP AMP, 1.2MHz, 0.5V/uS, 150 uV, 5-SOT-23, Supply Voltage Range:1.8V to 6V; Manufacturer: Analog Devices; Table: Operational Amplifiers; Elinvent_Num: 31-5113-00; Part Number: MCP6071T-E/OT; Component Kind: Standard; Component Type: Standard; Device: MCP6071T-E/OT; PackageDescription: SOT23-5, 0.95mm pitch; 5 pin, 1.60mm W X 2.90mm L X 1.45mm H body, IPC Medium; Manufacturer Part Number: MCP6071T-E/OT; Pin Count: 5; Case: SOT23-5; Mounted: Yes; Socket: No; SMD: Yes; ComponentHeight: 1.45mm; Author: L.Karamfilov; HelpURL: \\IDT-SRV102\Bulgaria\Altium\Datasheets\22142_B_MCP6071.pdf; CreateDate: 29/10/2018; LatestRevisionDate: 29/10/2018